# EAGLE design board (EAGLE 6.5.0)
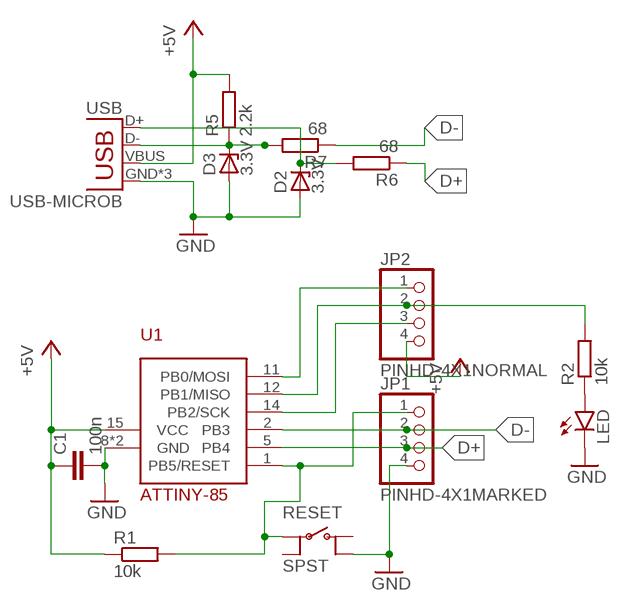
[diagram p0: schematic, sheet 1]

## Parts
C1  100n  C-EUC0603  [C0603]
D2  3.3V  ZENER-DIODESOD80C  [SOD80C]
D3  3.3V  ZENER-DIODESOD80C  [SOD80C]
JP1  PINHD-4X1MARKED  [PINHD-1X4-MARKED]
JP2  PINHD-4X1NORMAL  [PINHD-1X4]
LED  LED0603  [LED-0603]
R1  10k  R-EU_R0402  [R0402]
R2  10k  R-EU_R0402  [R0402]
R5  2.2k  R-EU_R0402  [R0402]
R6  68  R-EU_R0402  [R0402]
R7  68  R-EU_R0402  [R0402]
RESET  SPST  [WUERTH-SPST-SMD]
U1  ATTINY-85  ATTINY-85QFN-EARTHED-CENTER  [QFN20]
USB  USB-MICROB  [USB-MICROB]

## Nets
+5V: C1.1 JP2.4 R1.1 R5.2 U1.15(VCC) USB.VBUS
D+: JP1.3 R6.1 U1.5(PB4)
D-: JP1.2 R7.1 U1.2(PB3)
GND: C1.2 D2.A D3.A JP1.4 LED.C RESET.4(O2) U1.8(GND) U1.EP(GND) USB.GND USB.MT1(GND) USB.MT2(GND)
N$3: JP1.1 R1.2 RESET.1(P) U1.1(PB5/RESET)
N$4: JP2.1 U1.11(PB0/MOSI)
N$7: LED.A R2.1
N$8: D3.C R5.1 R7.2 USB.D-
N$9: D2.C R6.2 USB.D+
N$25: JP2.3 U1.14(PB2/SCK)
N$26: JP2.2 R2.2 U1.12(PB1/MISO)
Unconnected: RESET.2(O) RESET.3(P2)

## Library data of the parts
C1 = rcl:C-EU: CAPACITOR, European symbol
D2 D3 = diode:ZENER-DIODE: Z-Diode
JP1 JP2 = OwnStuff:PINHD-4X1
LED = SparkFun-LED:LED: LEDs Standard schematic elements and footprints for 5mm, 3mm, 1206, and 0603 sized LEDs. 5mm - Spark Fun Electronics SKU : COM-00529 (and others)
R1 R2 R5-R7 = rcl:R-EU_: RESISTOR, European symbol
RESET = OwnStuff:SPST
U1 = OwnStuff:ATTINY-85
USB = SparkFun-Connectors:USB: USB Connectors USB-B-PTH is fully proven SKU : PRT-00139/CONN-08278 USB-miniB is fully proven SKU : PRT-00587 USB-A-PCB is untested. USB-A-H is throughly reviewed, but untested. Spark Fun Electronics SKU : PRT-00437 USB-B-SMT is throughly reviewed, but untested. Needs silkscreen touching up. USB-A-S has not been used/tested USB-MB-H has not been used/tested USB-MICROB has been used. CONN-09505; PROD_ID: CONN-09505

## Board
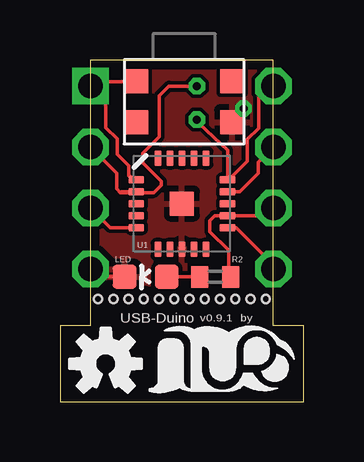
[diagram p1: board, top side]
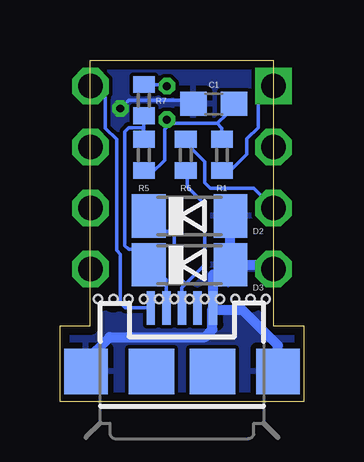
[diagram p2: board, bottom side, seen from below]

Size 10.16 x 14.25 mm. Coordinates in mm from the lower left corner, seen from the top.
Outline: 8.89,3.18 8.89,14.25 1.27,14.25 1.27,3.18 0,3.18 0,0 10.16,0 10.16,3.18 8.89,3.18
Copper layers (1*16): Top 0.0356mm / dielectric 1.5011mm / Bottom 0.0356mm
Design rules "LaenPCBOrder *": minimum track width 6mil, minimum drill 13mil, track to track 6mil, track to pad 6mil, pad to pad 6mil, via to via 6mil, smd to smd 6mil, copper to edge 15mil, drill to drill 6mil, minimum pad ring 7mil, minimum via ring 7mil, stop-mask expansion 3mil, vias tented up to drill 13mil, thermal gap 10mil
Holes 0.33 mm at 1.59,4.28 2.22,4.28 2.86,4.28 3.49,4.28 4.13,4.28 4.76,4.28 5.4,4.28 6.03,4.28 6.67,4.28 7.3,4.28 7.94,4.28 8.57,4.28

### Footprints (pad centres in the part's own frame; a part is rotated, then mirrored left to right if it is on the bottom)
C0603 = smd 1.1 x 1: 1 -0.85,0; 2 0.85,0
SOD80C = smd 1.4 x 1.8: A 1.7,0; C -1.7,0
PINHD-1X4-MARKED = drill 1.016 square: 1 -3.81,0 | drill 1.016 octagon: 2 -1.27,0; 3 1.27,0; 4 3.81,0
PINHD-1X4 = drill 1.016 octagon: 1 -3.81,0; 2 -1.27,0; 3 1.27,0; 4 3.81,0
LED-0603 = smd 1 x 1: A 0,-0.877; C 0,0.877
R0402 = smd 0.7 x 0.9: 1 -0.65,0; 2 0.65,0
WUERTH-SPST-SMD = smd 1 x 1: 1 2,-1; 2 2,0.7; 3 -2,-1; 4 -2,0.7
QFN20 = smd 0.65 x 0.3: 1 -1.9,1; 2 -1.9,0.5; 3 -1.9,0; 4 -1.9,-0.5; 5 -1.9,-1; 11 1.9,-1; 12 1.9,-0.5; 13 1.9,0; 14 1.9,0.5; 15 1.9,1 | smd 0.3 x 0.65: 6 -1,-1.9; 7 -0.5,-1.9; 8 0,-1.9; 9 0.5,-1.9; 10 1,-1.9; 16 1,1.9; 17 0.5,1.9; 18 0,1.9; 19 -0.5,1.9; 20 -1,1.9 | smd 1 x 1: EP 0,0
USB-MICROB = smd 0.35 x 1.4: D+ 0,2.65; D- -0.65,2.65; GND 1.3,2.65; ID 0.65,2.65; VBUS -1.3,2.65 | smd 1.8 x 1.9: MT1 -4,0; MT2 4,0 | smd 1.9 x 1.9: P$1 -1.27,0; P$2 1.27,0

### Placement (x,y rotation side)
C1  3.75,12.42 180 bottom
D2  4.76,7.75 0 bottom
D3  4.76,5.71 0 bottom
JP1  1.27,9.35 270 top
JP2  8.89,9.35 90 top
LED  3.57,5.21 90 top
R1  3.41,10.29 270 bottom
R2  6.47,5.21 0 top
R5  6.67,10.29 270 bottom
R6  4.92,10.29 270 bottom
R7  6.67,12.57 270 bottom
RESET  5.17,12.36 180 top
U1  5.08,8.26 0 top
U$1  [OSHW-LOGO-S]  1.91,1.59 0 top
U$2  [LOGO-SILKSCREEEN-S]  6.67,1.27 0 top
USB  5.08,1.27 0 bottom

### Tracks (layer width: path | path; a pad name or v marks a point on that pad's centre or on a via)
+5V  (via drill 0.33)
  Top 0.152: JP2.4 8.73,13.16 8.27,12.69 8.27,11.41 7.8,10.94 7.8,10.03 6.98,9.21 U1.15 6.98,10.49 5.8,11.59 5.72,11.66 v5.7,11.76
  Bottom 0.152: 6.35,9.53 5.8,10.08 5.8,11.36 5.56,11.6 | 6.35,9.53 6.87,9.53 | 3.35,11.21 3.35,11.11 R1.1 3.41,11.41 3.6,11.6 | 5.56,11.6 3.6,11.6 | 3.6,11.6 3.21,11.99 C1.1 | USB.VBUS 7.44,3.92 7.65,4.13 7.65,6.16 7.8,6.31 7.8,10.94 8.27,11.41 8.27,12.69 8.73,13.16 JP2.4 | 5.56,11.6 5.63,11.6 v5.7,11.76 | R5.2 6.46,9.64 6.35,9.53
D+
  Top 0.152: U1.5 2.09,7.26 JP1.3
  Bottom 0.152: R6.1 4.83,10.7 4.13,10 4.13,9.13 3.89,8.89 2.09,8.89 JP1.3
D-  (via drill 0.33)
  Top 0.152: U1.2 2.56,8.76 2.52,8.72 | JP1.2 2.36,9.53 2.36,8.88 2.52,8.72 | 2.52,8.72 3.92,8.72 4.23,9.03 4.23,9.19 3.45,9.97 3.45,10.36 4.13,11.04 4.13,12.75 4.54,13.16 v5.7,13.16
  Bottom 0.152: R7.1 5.77,13.22 v5.7,13.16
GND  (via drill 0.33)
  Top 0.152: LED.C 1.59,5.21 JP1.4 | 6.98,11.43 7.17,11.61 | 7.17,11.61 RESET.4 | 7.17,11.61 7.65,12.09 v7.65,12.22
  Bottom 0.152: 3.78,5.32 3.38,5.71 D3.A | C1.2 4.76,12.57 7.3,12.57 v7.65,12.22
  Bottom 0.406: D3.A D2.A | 3.17,5.71 D3.A | D3.A 1.45,5.71 JP1.4 | USB.MT2 1.08,2.35 2.54,3.81 3.67,3.81 USB.GND | USB.MT1 9.08,1.72 8.09,2.7 4.13,2.7 3.81,3.02 3.81,3.89 USB.GND | USB.GND 3.78,5.32
  pour Top: 0,0 10.16,0 10.16,3.18 8.89,3.18 8.89,14.61 1.27,14.61 1.27,3.18 0,3.18
  pour Bottom: 0,0 10.16,0 10.16,3.18 8.89,3.18 8.89,14.61 1.27,14.61 1.27,3.18 0,3.18
N$3
  Top 0.152: U1.1 2.86,9.42 2.86,9.84 2.38,10.32 2.38,10.95 1.91,11.43 1.91,12.52 JP1.1 1.73,13.16 1.91,13.34 3.14,13.34 RESET.1
  Bottom 0.152: JP1.1 1.91,12.52 1.91,11.43 2.38,10.95 2.38,10.32 3.06,9.64 R1.2
N$4
  Top 0.152: U1.11 7.35,7.26 8.89,5.71 JP2.1
N$7
  Top 0.152: 4.35,5.37 LED.A R2.1
N$8
  Bottom 0.152: USB.D- 5.73,5.1 6.35,5.71 D3.C 6.98,5.92 6.98,6.35 7.3,6.35 7.46,6.51 7.46,11.27 7.3,11.43 6.67,11.43 | 6.68,11.4 R5.1 6.67,11.43 | 6.67,11.43 R7.2
N$9
  Bottom 0.152: 6.65,7.62 D2.C 5.83,7.11 5.59,7.11 5.4,6.92 5.4,5.4 4.92,4.92 | USB.D+ 5.08,4.76 4.92,4.92 | 4.92,4.92 4.13,5.71 4.13,8.24 4.85,8.96 4.85,9.56 R6.2
N$25
  Top 0.152: U1.14 7.49,8.76 8.26,9.53 8.26,9.98 JP2.3
N$26
  Top 0.152: JP2.2 8.57,7.76 U1.12 6.45,7.76 6.25,7.56 6.25,7.09 7.03,6.31 7.03,5.31 R2.2

### Text on the board
tNames: USB-Duino | v0.9.1 | by